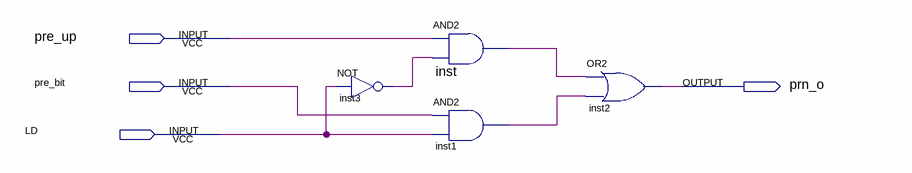
[diagram p0: schematic sheet]
// Quartus schematic mux.bdf as structural Verilog: 4 symbols, 4 pins
module mux (
  input  pre_up,
  input  pre_bit,
  input  LD,
  output prn_o
);

  wire inst1_out, inst3_out, inst_out;

  not inst3 (inst3_out, LD);
  and inst (inst_out, pre_up, inst3_out);
  and inst1 (inst1_out, pre_bit, LD);
  or inst2 (prn_o, inst_out, inst1_out);
endmodule
